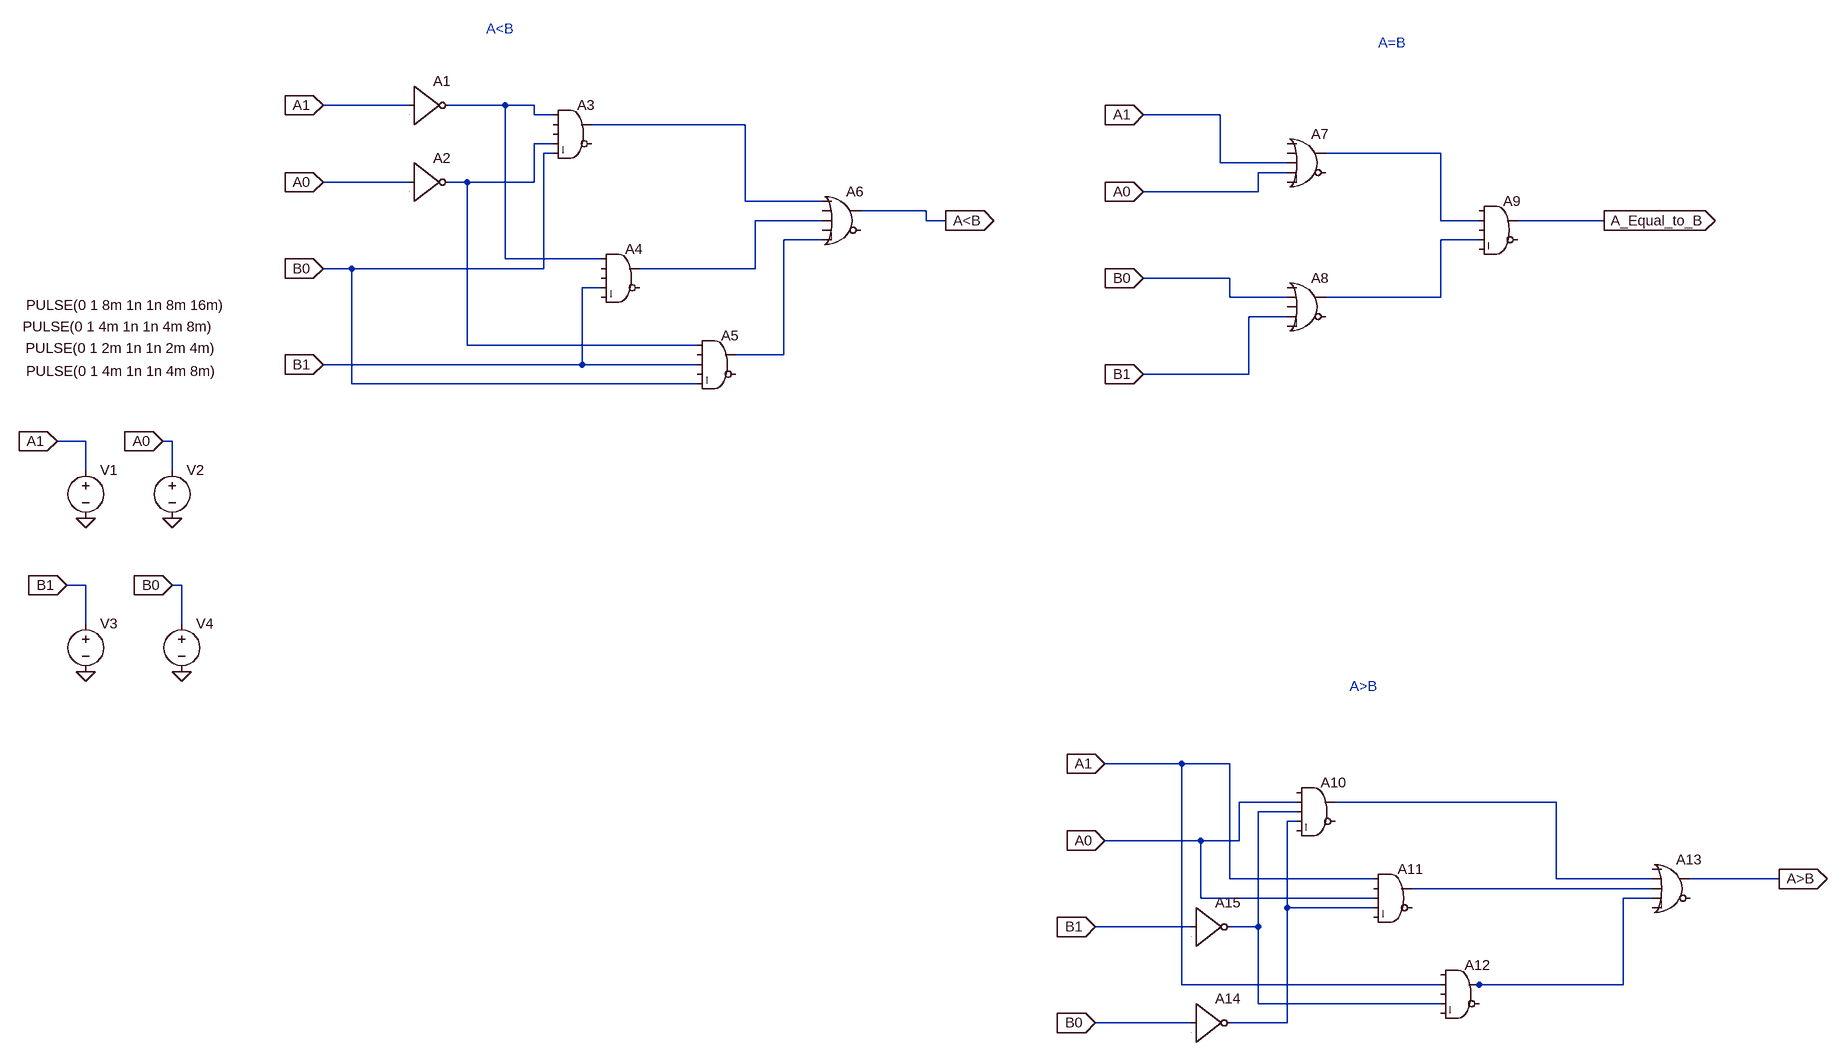
[diagram p0: schematic Draft2.asc]
Draft2.asc, the LTspice schematic file:
Version 4
SHEET 1 3460 1432
WIRE 832 -336 688 -336
WIRE 992 -336 896 -336
WIRE 1040 -336 992 -336
WIRE 1040 -320 1040 -336
WIRE 1072 -320 1040 -320
WIRE 2368 -320 2240 -320
WIRE 1392 -304 1136 -304
WIRE 1072 -272 1040 -272
WIRE 1072 -256 1056 -256
WIRE 2736 -256 2544 -256
WIRE 2368 -240 2368 -320
WIRE 2480 -240 2368 -240
WIRE 2480 -224 2432 -224
WIRE 832 -208 688 -208
WIRE 928 -208 896 -208
WIRE 1040 -208 1040 -272
WIRE 1040 -208 928 -208
WIRE 2432 -192 2432 -224
WIRE 2432 -192 2240 -192
WIRE 1392 -176 1392 -304
WIRE 1520 -176 1392 -176
WIRE 1712 -160 1584 -160
WIRE 1520 -144 1408 -144
WIRE 1712 -144 1712 -160
WIRE 1744 -144 1712 -144
WIRE 2736 -144 2736 -256
WIRE 2800 -144 2736 -144
WIRE 3008 -144 2864 -144
WIRE 1520 -112 1456 -112
WIRE 2800 -112 2736 -112
WIRE 992 -80 992 -336
WIRE 1152 -80 992 -80
WIRE 736 -64 688 -64
WIRE 1056 -64 1056 -256
WIRE 1056 -64 736 -64
WIRE 1408 -64 1408 -144
WIRE 1408 -64 1216 -64
WIRE 2384 -48 2240 -48
WIRE 1152 -32 1120 -32
WIRE 2384 -16 2384 -48
WIRE 2480 -16 2384 -16
WIRE 2736 -16 2736 -112
WIRE 2736 -16 2544 -16
WIRE 2480 16 2416 16
WIRE 928 64 928 -208
WIRE 1312 64 928 64
WIRE 1456 80 1456 -112
WIRE 1456 80 1376 80
WIRE 1120 96 1120 -32
WIRE 1120 96 688 96
WIRE 1312 96 1120 96
WIRE 2416 112 2416 16
WIRE 2416 112 2240 112
WIRE 736 128 736 -64
WIRE 1312 128 736 128
WIRE -224 224 -272 224
WIRE -80 224 -96 224
WIRE -224 272 -224 224
WIRE -80 272 -80 224
WIRE -224 464 -256 464
WIRE -64 464 -80 464
WIRE -224 528 -224 464
WIRE -64 528 -64 464
WIRE 2304 768 2176 768
WIRE 2384 768 2304 768
WIRE 2496 832 2400 832
WIRE 2928 832 2560 832
WIRE 2496 848 2432 848
WIRE 2496 864 2480 864
WIRE 2336 896 2176 896
WIRE 2400 896 2400 832
WIRE 2400 896 2336 896
WIRE 2384 960 2384 768
WIRE 2624 960 2384 960
WIRE 2928 960 2928 832
WIRE 3088 960 2928 960
WIRE 3328 960 3152 960
WIRE 3088 976 2688 976
WIRE 2336 992 2336 896
WIRE 2624 992 2336 992
WIRE 3088 992 3040 992
WIRE 2480 1008 2480 864
WIRE 2624 1008 2480 1008
WIRE 2320 1040 2160 1040
WIRE 2432 1040 2432 848
WIRE 2432 1040 2384 1040
WIRE 2304 1136 2304 768
WIRE 2736 1136 2304 1136
WIRE 2800 1136 2784 1136
WIRE 3040 1136 3040 992
WIRE 3040 1136 2800 1136
WIRE 2432 1168 2432 1040
WIRE 2736 1168 2432 1168
WIRE 2320 1200 2160 1200
WIRE 2480 1200 2480 1008
WIRE 2480 1200 2384 1200
FLAG -272 224 A1
IOPIN -272 224 In
FLAG -96 224 A0
IOPIN -96 224 In
FLAG -256 464 B1
IOPIN -256 464 In
FLAG -80 464 B0
IOPIN -80 464 In
FLAG -224 352 0
FLAG -80 352 0
FLAG -224 608 0
FLAG -64 608 0
FLAG 688 -336 A1
IOPIN 688 -336 In
FLAG 688 -208 A0
IOPIN 688 -208 In
FLAG 688 -64 B0
IOPIN 688 -64 In
FLAG 688 96 B1
IOPIN 688 96 In
FLAG 1744 -144 A<B
IOPIN 1744 -144 Out
FLAG 2240 -320 A1
IOPIN 2240 -320 In
FLAG 2240 -192 A0
IOPIN 2240 -192 In
FLAG 2240 -48 B0
IOPIN 2240 -48 In
FLAG 2240 112 B1
IOPIN 2240 112 In
FLAG 3008 -144 A_Equal_to_B
IOPIN 3008 -144 Out
FLAG 2176 768 A1
IOPIN 2176 768 In
FLAG 2176 896 A0
IOPIN 2176 896 In
FLAG 2160 1200 B0
IOPIN 2160 1200 In
FLAG 2160 1040 B1
IOPIN 2160 1040 In
FLAG 3328 960 A>B
IOPIN 3328 960 Out
SYMBOL voltage -224 256 R0
WINDOW 3 -99 -259 Left 2
WINDOW 123 0 0 Left 0
WINDOW 39 0 0 Left 0
SYMATTR InstName V1
SYMATTR Value PULSE(0 1 8m 1n 1n 8m 16m)
SYMBOL voltage -80 256 R0
WINDOW 3 -249 -223 Left 2
WINDOW 123 0 0 Left 0
WINDOW 39 0 0 Left 0
SYMATTR InstName V2
SYMATTR Value PULSE(0 1 4m 1n 1n 4m 8m)
SYMBOL voltage -224 512 R0
WINDOW 3 -100 -443 Left 2
WINDOW 123 0 0 Left 0
WINDOW 39 0 0 Left 0
SYMATTR InstName V3
SYMATTR Value PULSE(0 1 2m 1n 1n 2m 4m)
SYMBOL voltage -64 512 R0
WINDOW 3 -259 -405 Left 2
WINDOW 123 0 0 Left 0
WINDOW 39 0 0 Left 0
SYMATTR InstName V4
SYMATTR Value PULSE(0 1 4m 1n 1n 4m 8m)
SYMBOL Digital\\inv 832 -400 R0
SYMATTR InstName A1
SYMBOL Digital\\inv 832 -272 R0
SYMATTR InstName A2
SYMBOL Digital\\and 1104 -352 R0
SYMATTR InstName A3
SYMBOL Digital\\and 1184 -112 R0
SYMATTR InstName A4
SYMBOL Digital\\and 1344 32 R0
SYMATTR InstName A5
SYMBOL Digital\\or 1552 -208 R0
SYMATTR InstName A6
SYMBOL Digital\\or 2512 -304 R0
SYMATTR InstName A7
SYMBOL Digital\\or 2512 -64 R0
SYMATTR InstName A8
SYMBOL Digital\\and 2832 -192 R0
SYMATTR InstName A9
SYMBOL Digital\\and 2528 784 R0
SYMATTR InstName A10
SYMBOL Digital\\and 2656 928 R0
SYMATTR InstName A11
SYMBOL Digital\\and 2768 1088 R0
SYMATTR InstName A12
SYMBOL Digital\\or 3120 912 R0
SYMATTR InstName A13
SYMBOL Digital\\inv 2320 1136 R0
SYMATTR InstName A14
SYMBOL Digital\\inv 2320 976 R0
SYMATTR InstName A15
TEXT 960 -464 Left 2 ;A<B
TEXT 2632 -440 Left 2 ;A=B
TEXT 2584 632 Left 2 ;A>B

The netlist it stands for:
* Draft2.asc
V1 A1 0 PULSE(0 1 8m 1n 1n 8m 16m)
V2 A0 0 PULSE(0 1 4m 1n 1n 4m 8m)
V3 B1 0 PULSE(0 1 2m 1n 1n 2m 4m)
V4 B0 0 PULSE(0 1 4m 1n 1n 4m 8m)
A1 A1 0 0 0 0 N001 0 0 BUF
A2 A0 0 0 0 0 N003 0 0 BUF
A3 N001 0 0 N003 B0 0 N002 0 AND
A4 N001 0 0 B1 0 0 N005 0 AND
A5 N003 0 B1 0 B0 0 N006 0 AND
A6 N002 0 N005 0 N006 0 A<B 0 OR
A7 0 0 A1 A0 0 0 N004 0 OR
A8 0 B0 0 B1 0 0 N007 0 OR
A9 0 N004 0 N007 0 0 A_Equal_to_B 0 AND
A10 0 A0 N009 N010 0 0 N008 0 AND
A11 A1 0 A0 N010 0 0 N011 0 AND
A12 0 A1 0 N009 0 0 N012 0 AND
A13 0 N008 N011 N012 0 0 A>B 0 OR
A14 B0 0 0 0 0 N010 0 0 BUF
A15 B1 0 0 0 0 N009 0 0 BUF
* A<B
* A=B
* A>B
.backanno
.end